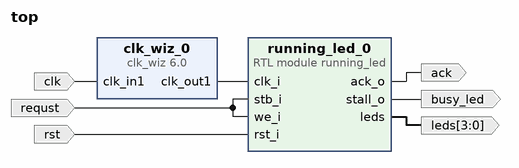
[diagram p0: block diagram of the top level]
# Vivado block design top, xc7a35ticsg324-1L, Vivado 2023.2
create_bd_design top

create_bd_port -dir O -from 3 -to 0 -type data leds
create_bd_port -dir I -type rst rst
set_property -dict {CONFIG.POLARITY ACTIVE_HIGH} [get_bd_ports rst]
create_bd_port -dir I -type clk clk
create_bd_port -dir O -type data busy_led
create_bd_port -dir I -type data requst
create_bd_port -dir O -type data ack

create_bd_cell -type module -reference running_led running_led_0
create_bd_cell -type ip -vlnv xilinx.com:ip:clk_wiz:6.0 clk_wiz_0
set_property -dict {CONFIG.USE_RESET false} [get_bd_cells clk_wiz_0]

# ---- connections ----

connect_bd_net -net clk_in1_0_1 [get_bd_ports clk] [get_bd_pins clk_wiz_0/clk_in1]
connect_bd_net [get_bd_pins clk_wiz_0/clk_out1] [get_bd_pins running_led_0/clk_i]
connect_bd_net [get_bd_ports requst] [get_bd_pins running_led_0/stb_i] [get_bd_pins running_led_0/we_i]
connect_bd_net -net rst_0_1 [get_bd_ports rst] [get_bd_pins running_led_0/rst_i]
connect_bd_net [get_bd_pins running_led_0/ack_o] [get_bd_ports ack]
connect_bd_net -net running_led_0_busy [get_bd_pins running_led_0/stall_o] [get_bd_ports busy_led]
connect_bd_net [get_bd_pins running_led_0/leds] [get_bd_ports leds]

validate_bd_design
save_bd_design
